# EAGLE design MRCS-Candlestick-Mic (EAGLE 7.7.0)
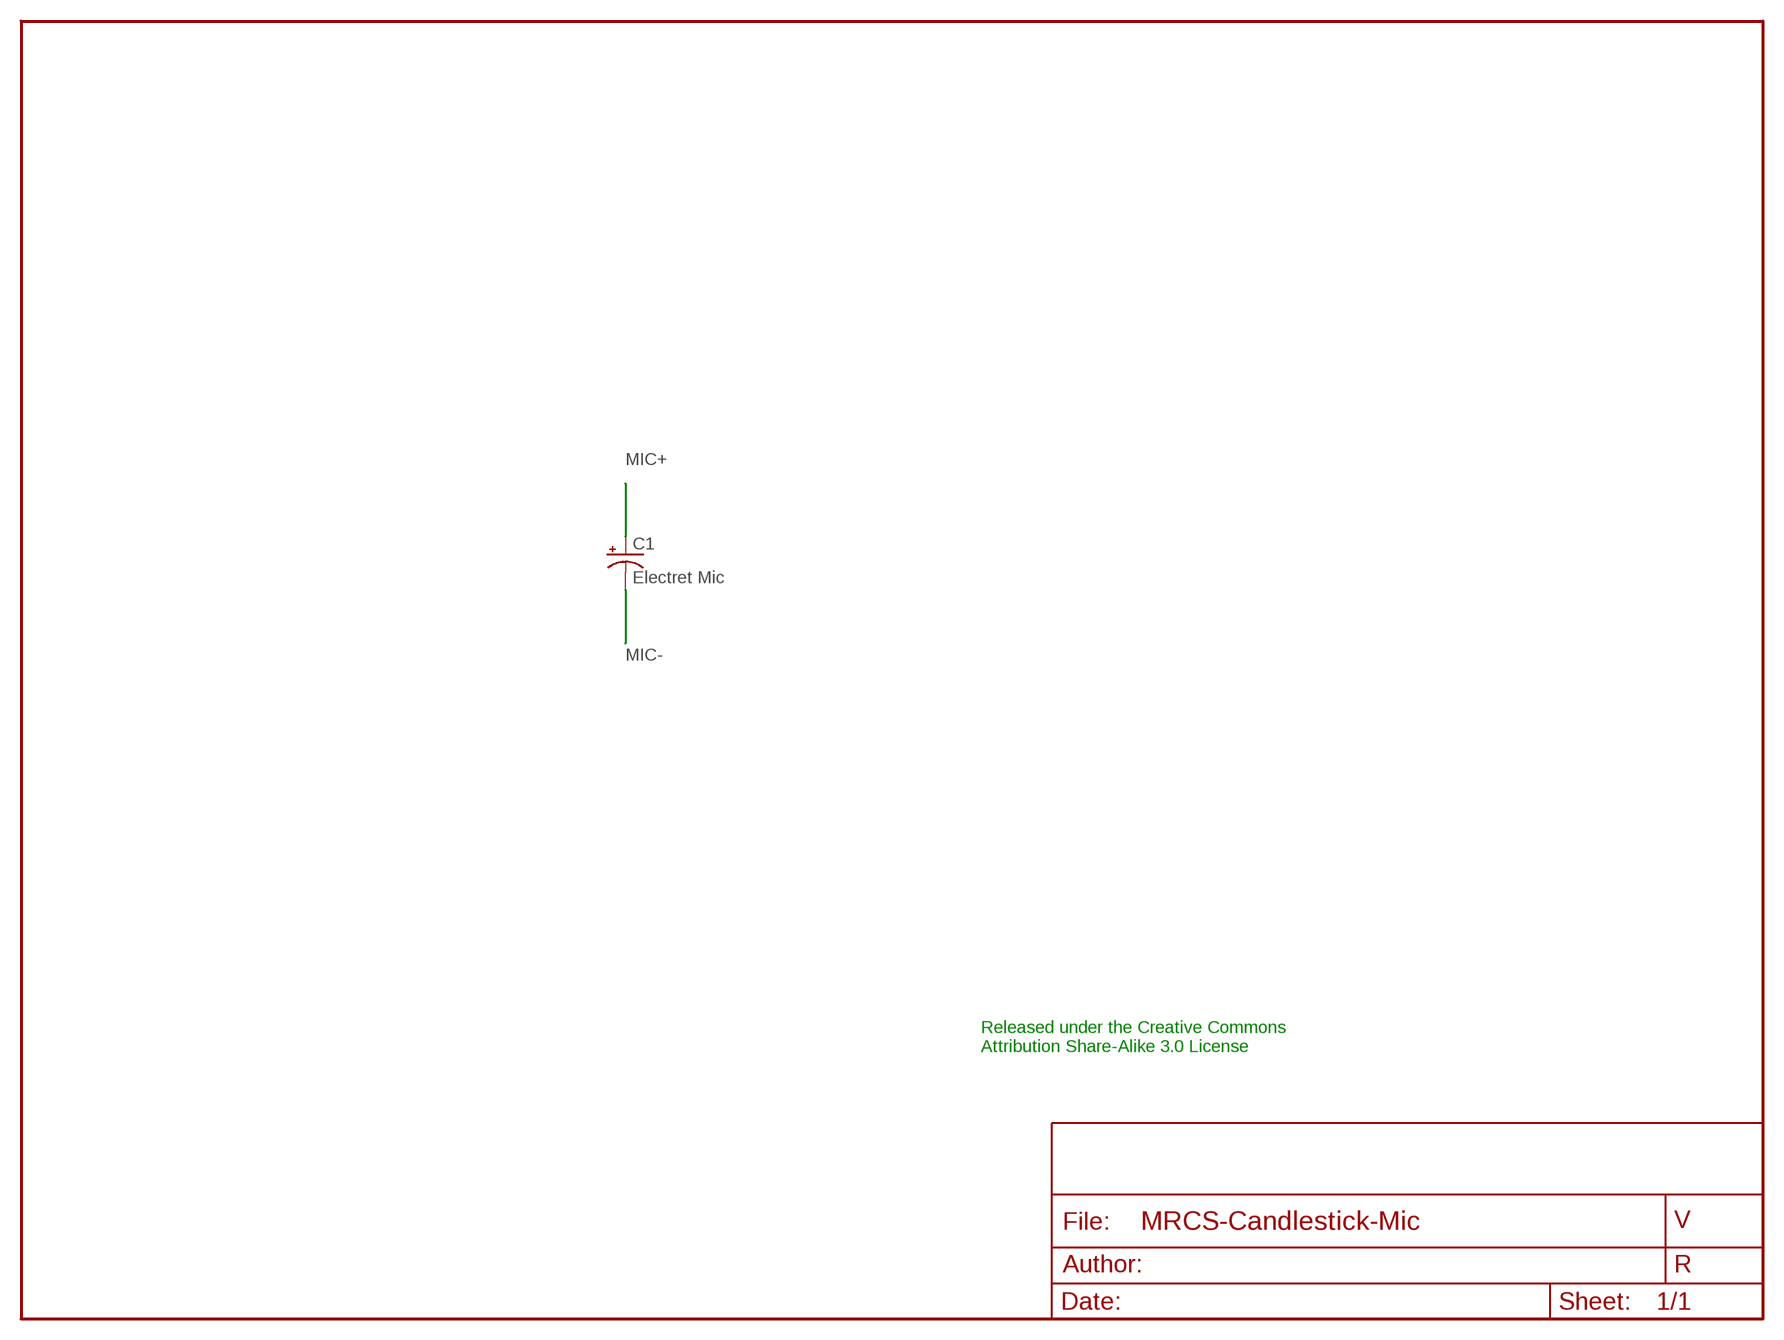
[diagram p0: schematic, sheet 1]

## Parts
C1  Electret Mic  CPOL-USE2-4  [E2-4]

## Nets
MIC+: C1.+
MIC-: C1.-

## Notes on the sheet
- Released under the Creative Commons
  Attribution Share-Alike 3.0 License

## Library data of the parts
C1 = rcl:CPOL-US: POLARIZED CAPACITOR, American symbol

## Board
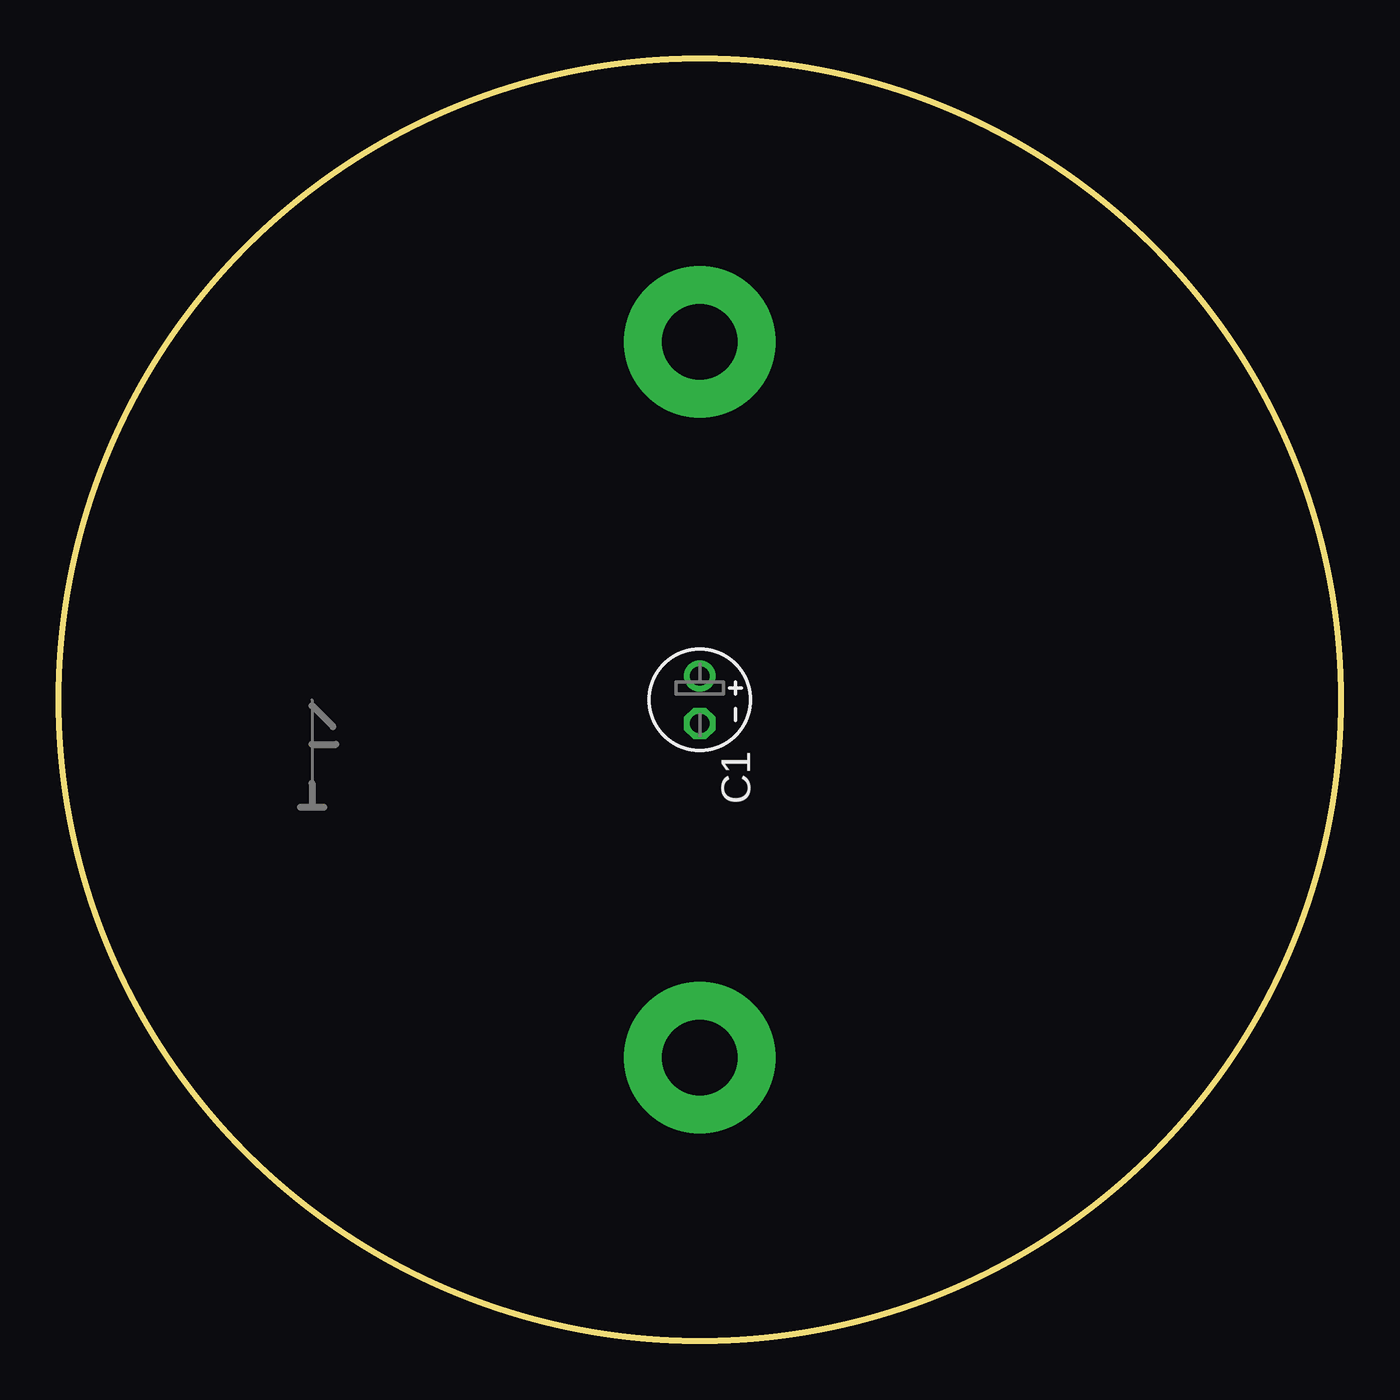
[diagram p1: board, top side]
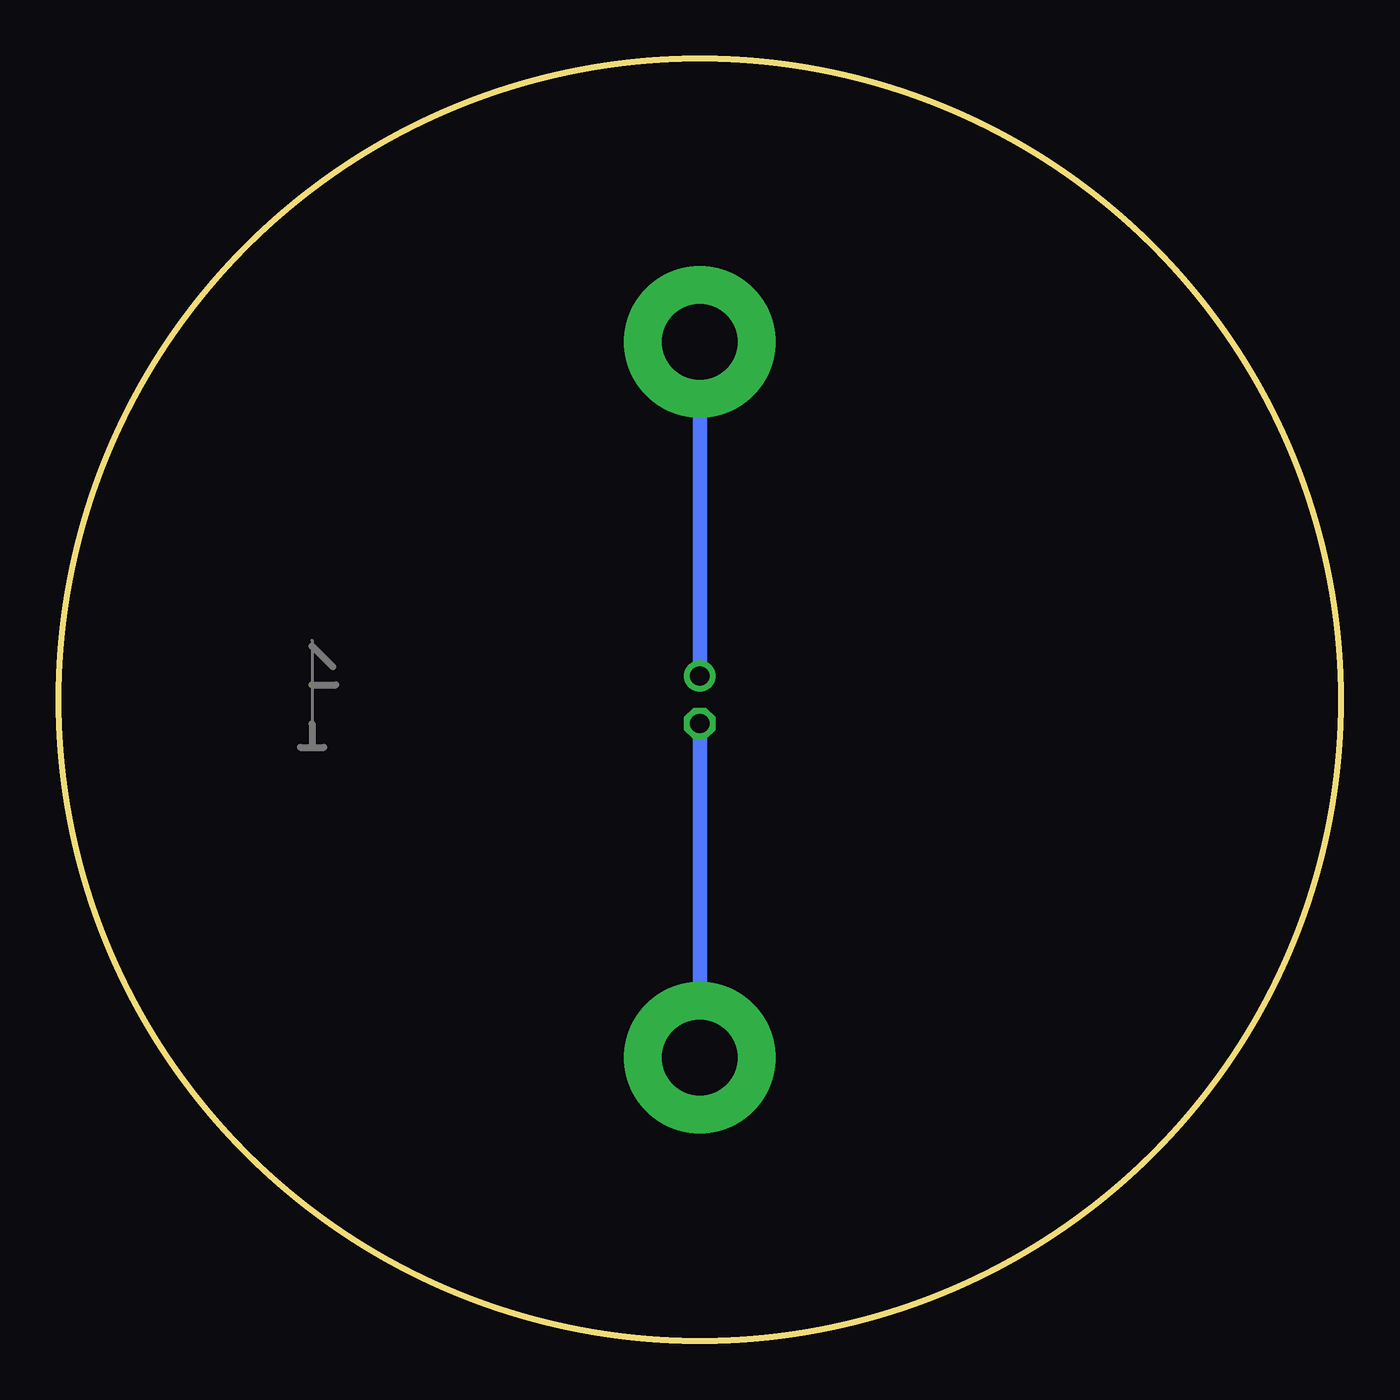
[diagram p2: board, bottom side, seen from below]

Size 54.61 x 54.61 mm. Coordinates in mm from the lower left corner, seen from the top.
Outline: circle at 27.3,27.3 radius 27.3
Copper layers (1*16): Top 0.035mm / dielectric 1.5mm / Bottom 0.035mm
Design rules "default": minimum track width 10mil, minimum drill 0.6mm, track to track 8mil, track to pad 8mil, pad to pad 8mil, via to via 8mil, smd to smd 8mil, copper to edge 40mil, drill to drill 8mil, minimum pad ring 10mil, minimum via ring 8mil, stop-mask expansion 4mil, vias tented up to drill 0mil, thermal gap 10mil

### Footprints (pad centres in the part's own frame; a part is rotated, then mirrored left to right if it is on the bottom)
E2-4 = drill 0.813 pad 1.27: + -1.016,0 | drill 0.813 pad 1.27 octagon: - 1.016,0

### Placement (x,y rotation side)
C1  27.3,27.3 270 top
U$1  [MRCSLOGOTOP]  9.52,22.22 0 top
U$2  [CA-PROP65WARNING]  13.33,31.11 90 top
U$3  [MRCSLOGOBTM]  37.47,24.76 0 top

### Tracks (layer width: path | path; a pad name or v marks a point on that pad's centre or on a via)
MIC+  (via drill 3.2 pad 6.45)
  Bottom 0.61: C1.+ v27.3,42.55
MIC-  (via drill 3.2 pad 6.45)
  Bottom 0.61: C1.- v27.3,12.06

### Text on the board
tDocu: FI XMTR Replacement
bDocu: + RED | - GREEN or / BLACK